# Altium schematic sheet Voeding.SchDoc: Soldeerstation
size A4; SheetNumber: 1; SheetTotal: 5
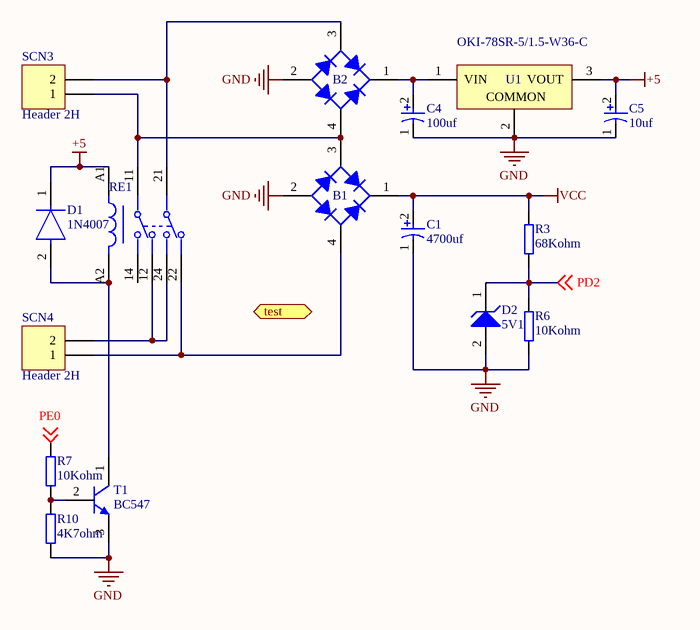
[diagram p0: Voeding.SchDoc]

## Parts
B1  Bridge_Rectifier  [ttf]  (value not drawn)
B2  Bridge_Rectifier  [ttf]  (value not drawn)
C1  4700uf  [CE_D25_L25_THT]
C4  100uf  [CE_D8_L10]
C5  10uf  [CE_D4_L5,4]
D1  1N4007  [SOD-123FL]
D2  5V1  [SOD-123FL]
R3  68Kohm  [R_0805_M]
R6  10Kohm  [R_0805_M]
R7  10Kohm  [R_0805_M]
R10  4K7ohm  [R_0805_M]
RE1  RELAY_GENERAL_PURPOSE  [RT42]  (value not drawn)
SCN3  Header 2H  [Connector_2x1_p_5mm]
SCN4  Header 2H  [Connector_2x1_p_5mm]
T1  BC547  [SOT_23]
U1  OKI-78SR-5/1.5-W36-C  [OKI78SR515W36C]

## Ports
test (bidir)

## Nets
+5: C5.2 D1.1(C) RE1.A1 U1.3(VOUT)
GND: B1.2(A) B2.2(A) C1.1 C4.1 C5.1 D2.2(A) R6.2 R10.2 T1.3(E) U1.2(COMMON)
VCC: B1.1(K) C1.2 R3.2
PD2: D2.1(K) R3.1 R6.1 ; off-sheet PD2
PE0: R7.2 ; off-sheet PE0
NetB1_3: B1.3(C) B2.4(C) RE1.11 SCN3.1
NetB1_4: B1.4(C) RE1.22 SCN4.1
NetB2_1: B2.1(K) C4.2 U1.1(VIN)
NetB2_3: B2.3(C) RE1.21 SCN3.2
NetD1_2: D1.2(A) RE1.A2 T1.1(C)
NetR7_1: R7.1 R10.1 T1.2(B)
NetRE1_12: RE1.12 RE1.24 SCN4.2

Not connected (* = marked no-connect by the designer): RE1 14

## Library data of the parts
B1 B2 = Bridge_Rectifier: Manufacturer: Diodes Inc; Average Rectified Current-Max: 0.8A; Reverse Voltage-Max [Vrrm]: 600V; Forward Voltage: 1V; Peak Current-Max: 30A; Reverse Current-Max: 5µA; Package Version: 05/2016; Package URL: http://www.diodes.com/_files/packages/MiniDIP.pdf; Datasheet Version: Rev. 13-2, 12/2010; Datasheet URL: http://www.diodes.com/_files/datasheets/ds17003.pdf; Mounting Technology: SurfaceMount; Manufacturer URL: http://www.diodes.com/; Package Reference: MiniDIP-4; Package Description: 4-Pin Small Outline Integrated Circuit, Body 4.7 x 3.8 mm, Pitch 2.5 mm
C1 C4 C5 = Capacitor_Electrolytic: Manufacturer: Panasonic; Voltage Rating: 25 V; ComponentLink2URL: http://industrial.panasonic.com/cdbs/www-data/pdf/RDE0000/ABA0000C1181.pdf; Height: 10.2 mm; Max Operating Temperature: 105 degC; PackageReference: EEE-FK1E221P; ComponentLink1Description: Manufacturer URL; ComponentLink1URL: http://www.panasonic.com/; Mount: Surface Mount; REACH SVHC: No SVHC; Min Operating Temperature: -55 degC; ComponentLink2Description: Datasheet; DatasheetVersion: 03/2016; Length: 10.2 mm; RoHSCompliant: true; Packaging: Tape and Reel; Package Quantity: 500; Lead Pitch: 3.1 mm; Pins: 2; PackageDescription: 2-Pin Electrolytic Aluminum Capacitor, Body 8.3 x 8.3 mm; Mounting Technology: Surface Mount
D1 = Diode: Manufacturer: Diotec; Max Surge Forward Current: 27A; Forward Current: 1A; Max Junction Temp: +175°C; Reverse Voltage: 1000V; Value: 15pF; Peak Reverse Current: 5uA; Category: Diode; Temperature Range Low: -50°C; Automotive: No; Temperature: -50°C to +175°C; Lead Free: Yes; ComponentLink2Description: Datasheet; Max Repetitive Reverse Voltage: 1000V; ComponentLink2URL: https://datasheet.octopart.com/1N4007-Diotec-datasheet-62346875.pdf; Manufacturer Part Number: 1N4007; Device Class L3: Rectifier Diodes; Height: 2.8mm; Octopart: https://octopart.com/1n4007-diotec-4040411; Package: 1N4007; Temperature Range High: +175°C; Device Class L1: Discrete Semiconductors; Device Class L2: Diodes; RoHS: TRUE; Capacitance: 15pF; Ipc Land Pattern Name: DIOAD888W100L520D280
D2 = Zener_Diode: Manufacturer: On Semiconductor; PartNumber: 1SMB5920BT3G; Packing: Tape and Reel; VZ Typ (V): 6.2; PackageDescription: 2-Pin Small Molded Package, J-Bend Lead, Body 4.33 x 3.625 mm; Mounting Technology: Surface Mount; PackageVersion: Rev. H, 05/2011; ComponentLink1Description: Manufacturer URL; RoHS: Pb-Free; DatasheetVersion: Rev. 8; ComponentLink2Description: Datasheet; ComponentLink2URL: http://www.onsemi.com/pub_link/Collateral/1SMB5913BT3-D.PDF; ComponentLink1URL: http://www.onsemi.com/; ComponentLink3Description: Package Specification; PackageReference: SMB-2-403A-03_H; ComponentLink3URL: http://www.onsemi.com/pub_link/Collateral/1SMB5913BT3-D.PDF
R3 R6 R7 R10 = Resistor: Manufacturer: Vishay Dale; Part Number: CRCW08050000Z0EA
RE1 = RELAY_GENERAL_PURPOSE: Manufacturer Part Number: RT424005; Manufacturer: TE Connectivity; Coil Power: 403mW; Throw Configuration: DPDT; Coil Voltage: 5V; Number Of Contacts: 2; Coil Resistance: 62Ω; Current Rating: 8A; Coil Type: Non-Latching; Category: Relay; Octopart: https://octopart.com/5-1393243-9-te+connectivity-41835766; Device Class L3: Power Relays; ComponentLink2URL: https://www.te.com/commerce/DocumentDelivery/DDEController?Action=showdoc&DocId=Data+Sheet%7FRT2%7F1014%7Fpdf%7FEnglish%7FENG_DS_RT2_1014.pdf%7F5-1393243-9; Ambient Temperature Range High: +85°C; ComponentLink2Description: Datasheet; Digikey Description: RELAY GENERAL PURPOSE DPDT 8A 5V; Package: RT424005; Automotive: No; Device Class L1: Electromechanical; Height: 15.7mm; Device Class L2: Relays; Ambient Temperature Range Low: -40°C; Mouser Description: General Purpose Relay, Rt2 Series, Power, Non Latching, Dpdt, 5 Vdc, 8 A Rohs Compliant: Yes; Lead Free: Yes; RoHS: TRUE
SCN3 SCN4 = Header 2H: ScrewConnector, 2-Pin, Right Angle; LatestRevisionDate: 17-Jul-2002; LatestRevisionNote: Re-released for DXP Platform.; Publisher: Altium Limited
T1 = Transistor_NPN: Manufacturer: On Semiconductor; PartNumber: BC547C; IC Continuous (A): 0.1; fT Min (MHz): 150; Packing: Bulk Box; Polarity: NPN; Mounting Technology: Through Hole; ComponentLink1URL: http://www.onsemi.com/; ComponentLink1Description: Manufacturer URL; ComponentLink3URL: http://www.onsemi.cn/pub_link/Collateral/2N6426-D.PDF; DatasheetVersion: Rev. 7; PackageVersion: Rev. AM; RoHS: FALSE; ComponentLink2URL: http://www.onsemi.com/pub_link/Collateral/BC546-D.PDF; ComponentLink3Description: Package Specification; PackageDescription: 3-Pin Transistor Outline, Body 4.825 x 3.685 mm, Pitch 1.27 mm; PackageReference: TO-92-3-29-11_AM_SL; ComponentLink2Description: Datasheet
U1 = DC/DC Converter: Manufacturer: Murata; Current - Output (Max): 1.5A; Power (Watts) - Max: 8W; Efficiency: 90.5%; Voltage - Input (Min): 7V; Voltage - Input (Max): 36V; Voltage - Output 1: 5V; Number of Outputs: 1; Package / Case: 3-SIPModule; Features: SCP; Type: LinearRegulatorReplacement; Size / Dimension: 0.41"Lx0.30"Wx0.65"H(10.4mmx7.6mmx16.5mm); Datasheet URL: https://datasheet.ciiva.com/8006/1790439-8006672.pdf; Datasheet Version: Oct-13; Power (Watts) - Manufacture Series: 8W; Voltage - Output 2: -; Series: Okami™OKI-78SR; Family: DCDCConverters; Manufacturer URL: http://www.murata.com/; Category: PowerSupplies-BoardMount; Voltage - Isolation: -; Packaging: Tube; Applications: ITE(Commercial); Mounting Type: ThroughHole; Voltage - Output 3: -; Operating Temperature: -40degC~85degC